# EAGLE schematic kartSPKR_rev_0 (EAGLE 9.4.2)
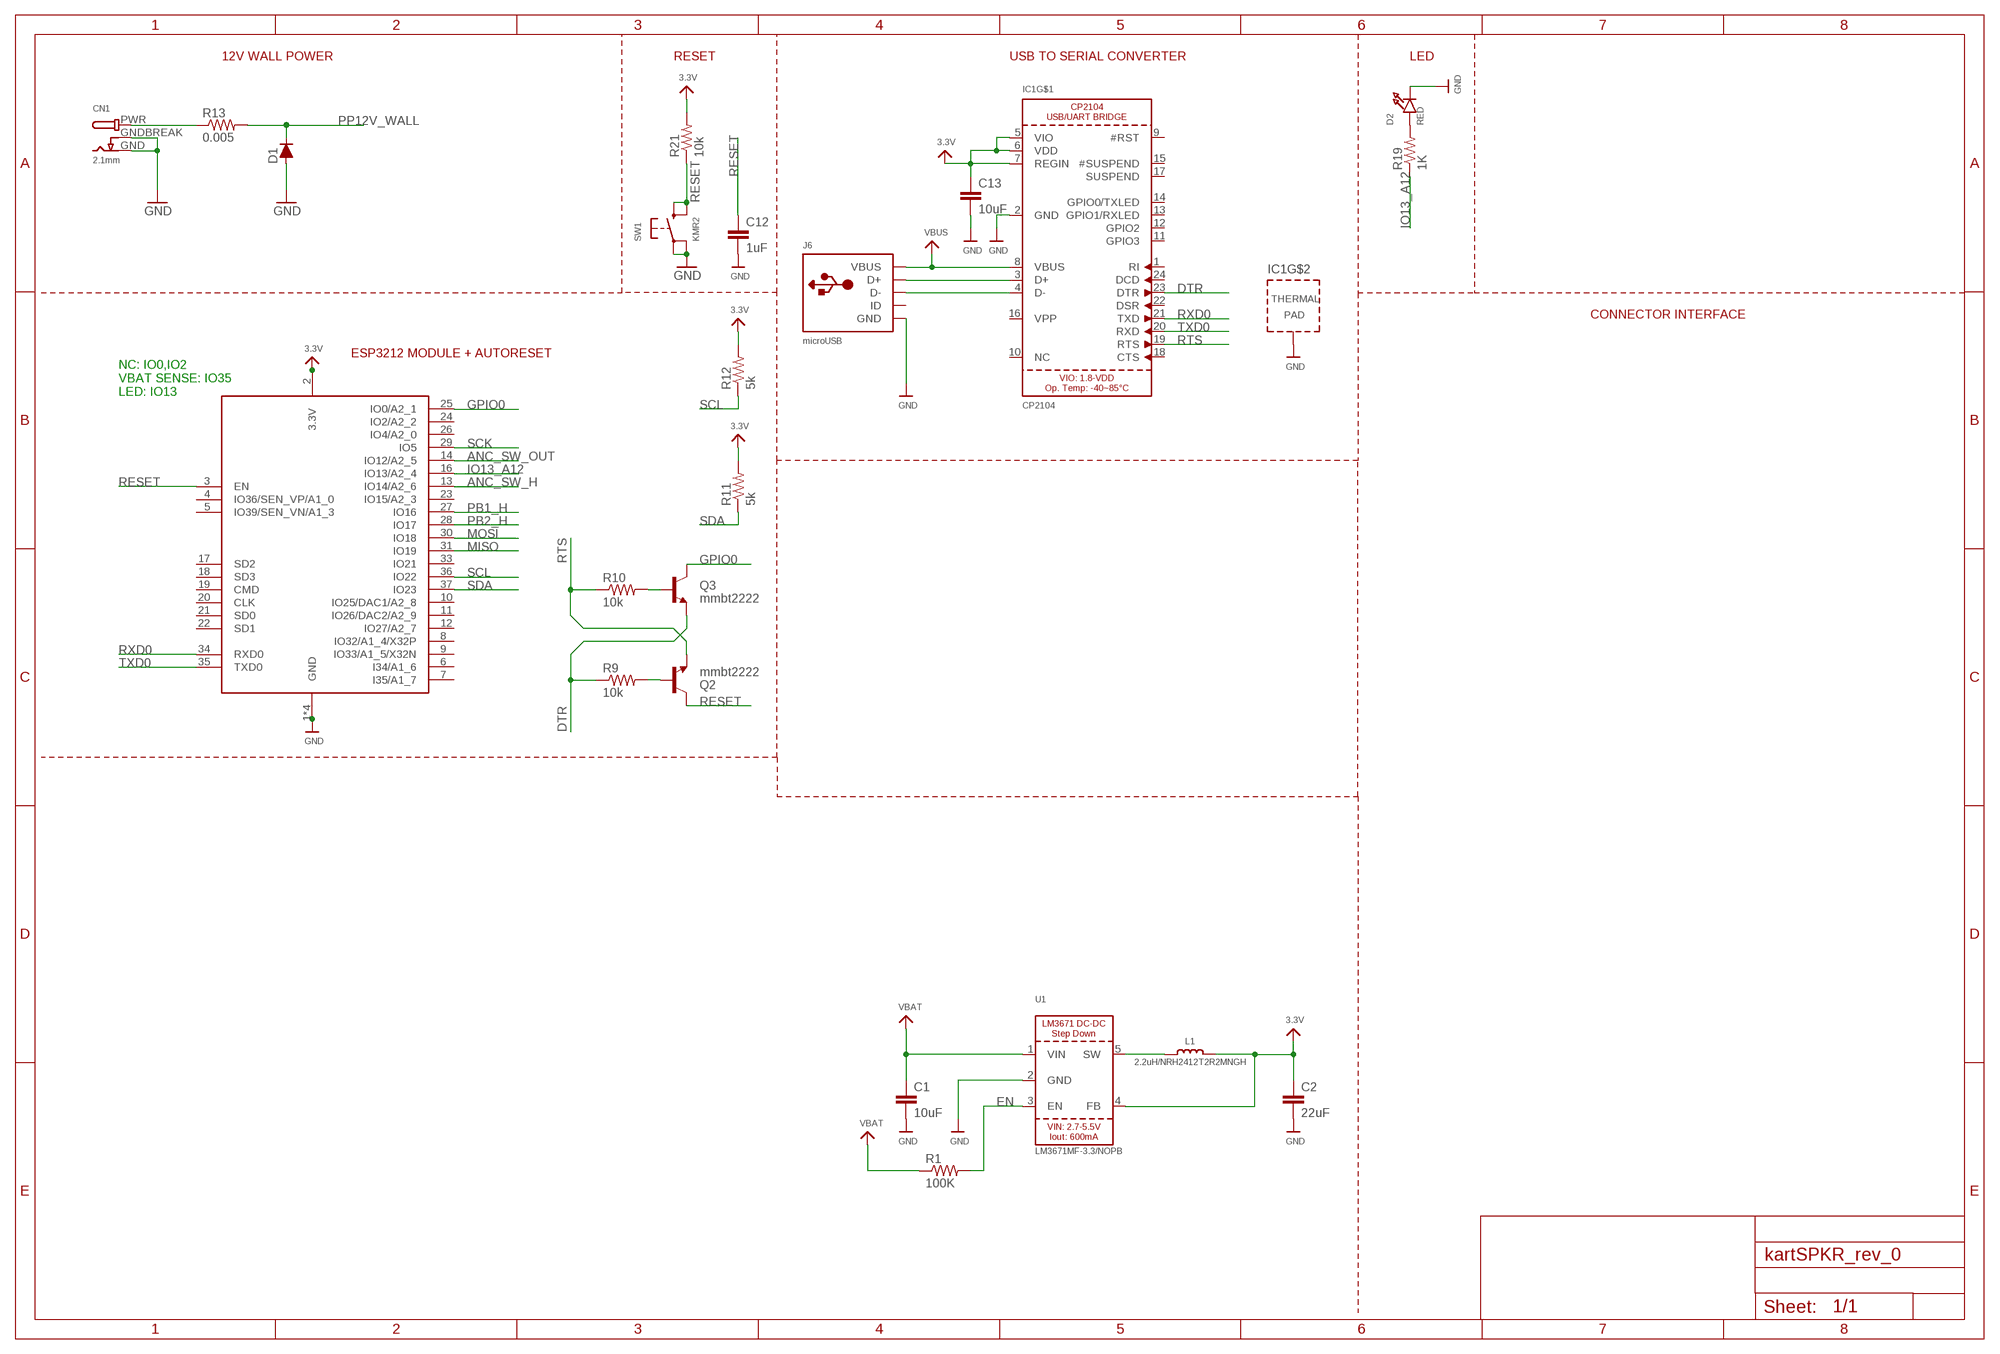
[diagram p0: schematic, sheet 1]

## Parts
C1  10uF  C-EUC0603  [C0603]
C2  22uF  C-EUC0603  [C0603]
C12  1uF  C-EUC0603  [C0603]
C13  10uF  C-EUC0603  [C0603]
CN1  2.1mm  DCBARRELSMT_CORRECT  [DCJACK_2MM_SMT]
D1  D-FILL-SMB  [SMB]
D2  RED  LED0805_NOOUTLINE  [CHIPLED_0805_NOOUTLINE]
IC1  CP2104  [QFN24_4MM_SMSC]
J6  microUSB  USBMICRO_20329  [4UCONN_20329]
L1  2.2uH/NRH2412T2R2MNGH  INDUCTORNRH2412T  [INDUCTOR_TAIYOYUDEN_NRH2412T]
Q2  mmbt2222  TRANSISTOR_NPNSOT23-3  [SOT23-3]
Q3  mmbt2222  TRANSISTOR_NPNSOT23-3  [SOT23-3]
R1  100K  R-US_R0603  [R0603]
R9  10k  R-US_R0603  [R0603]
R10  10k  R-US_R0603  [R0603]
R11  5k  R-US_R0603  [R0603]
R12  5k  R-US_R0603  [R0603]
R13  0.005  R-US_R1206  [R1206]
R19  1K  R-US_R0603  [R0603]
R21  10k  R-US_R0603  [R0603]
SW1  KMR2  SWITCH_TACT_SMT4.6X2.8  [BTN_KMR2_4.6X2.8]
U1  LM3671MF-3.3/NOPB  VREG_LM3671  [SOT23-5]
X1  ESP32_WROOM32_SKINNY  [WROOM32_SKINNY]

## Nets
3.3V: C2.1 C13.1 IC1.5(VIO) IC1.6(VDD) IC1.7(REGIN) L1.2 R11.2 R12.2 R21.2 U1.4(FB) X1.2(3.3V)
ANC_SW_H: X1.13(IO14/A2_6)
ANC_SW_OUT: X1.14(IO12/A2_5)
DTR: IC1.23(DTR) Q3.2(E) R9.1
EN: R1.2 U1.3(EN)
GND: C1.2 C2.2 C12.2 C13.2 CN1.GND CN1.GNDBREAK D1.2(A) D2.C IC1.2(GND) IC1.THERM(TP) J6.BASE@1(GND) J6.BASE@2(GND) J6.GND J6.SPRT@1(GND) J6.SPRT@2(GND) J6.SPRT@3(GND) J6.SPRT@4(GND) SW1.A'(P1) SW1.A(P) U1.2(GND) X1.1(GND) X1.15(GND) X1.38(GND) X1.P$1(GND)
GPIO0: Q3.3(C) X1.25(IO0/A2_1)
IO13_A12: R19.1 X1.16(IO13/A2_4)
MISO: X1.31(IO19)
MOSI: X1.30(IO18)
N$1: CN1.PWR R13.1
N$2: IC1.3(D+) J6.D+
N$5: D2.A R19.2
N$6: IC1.4(D-) J6.D-
N$12: Q2.1(B) R9.2
N$13: Q3.1(B) R10.2
N$17: L1.1 U1.5(SW)
PB1_H: X1.27(IO16)
PB2_H: X1.28(IO17)
PP12V_WALL: D1.1(C) R13.2
RESET: C12.1 Q2.3(C) R21.1 SW1.B'(S1) SW1.B(S) X1.3(EN)
RTS: IC1.19(RTS) Q2.2(E) R10.1
RXD0: IC1.21(TXD) X1.34(RXD0)
SCK: X1.29(IO5)
SCL: R12.1 X1.36(IO22)
SDA: R11.1 X1.37(IO23)
TXD0: IC1.20(RXD) X1.35(TXD0)
VBAT: C1.1 R1.1 U1.1(VIN)
VBUS: IC1.8(VBUS) J6.VBUS
Unconnected: IC1.1(RI) IC1.9(#RST) IC1.10(NC) IC1.11(GPIO3) IC1.12(GPIO2) IC1.13(GPIO1/RXLED) IC1.14(GPIO0/TXLED) IC1.15(#SUSPEND) IC1.16(VPP) IC1.17(SUSPEND) IC1.18(CTS) IC1.22(DSR) IC1.24(DCD) J6.ID X1.4(IO36/SEN_VP/A1_0) X1.5(IO39/SEN_VN/A1_3) X1.6(I34/A1_6) X1.7(I35/A1_7) X1.8(IO32/A1_4/X32P) X1.9(IO33/A1_5/X32N) X1.10(IO25/DAC1/A2_8) X1.11(IO26/DAC2/A2_9) X1.12(IO27/A2_7) X1.17(SD2) X1.18(SD3) X1.19(CMD) X1.20(CLK) X1.21(SD0) X1.22(SD1) X1.23(IO15/A2_3) X1.24(IO2/A2_2) X1.26(IO4/A2_0) X1.33(IO21)

## Notes on the sheet
- 12V WALL POWER | RESET | USB TO SERIAL CONVERTER | LED
- CONNECTOR INTERFACE
- ESP3212 MODULE + AUTORESET
- NC: IO0,IO2
  VBAT SENSE: IO35
  LED: IO13

## Library data of the parts
C1 C2 C12 C13 = rcl:C-EU: CAPACITOR, European symbol
CN1 = microbuilder:DCBARREL: DC Barrel Jack DCJACK_1.3MM_PTH - Through Hole 1.3mm Jack (4UConnector: 05536) DCJACK_2MM_PTH - Through Hole 2.0/2.1 Jack (4UConnector: 05537) DCJACK_2MM_SMT - SMT 2.0/2.1mm Jack(4UConnector: 03267)
D1 = semicon-smd-ipc:D-FILL-: DIODE filled
D2 = microbuilder:LED: LED 0603 - 0603 Surface Mount Package 2mA: Green LED - Low Power (3.9mcd, 2ma, 1.7Vf) - Digikey: 475-2709-2-ND Orange LED - Low Power (9.8mcd, 2ma, 1.8Vf) - Digikey: 475-1194-2-ND Red LED - Low Power (5mcd, 2ma, 1.8Vf) - Digikey: 475-1195-2-ND Yellow LED - Low Power (7mcd, 2ma, 1.8Vf) - Digikey: 475-1196-2-ND 5mA: Blue LED - Low Power (17mcd, 5ma, 2.9Vf) - Digikey: LNJ937W8CRACT-ND 0805 - 0805 Surface Mount Package 2mA: Red LED (8.8mcd, 2mA, 1.8Vf, Clear) - Low Power [Digikey: 475-2510-1-ND] Green LED (5mcd, 2mA, 1.8Vf, Clear) - Low Power [Digikey: 475-2730-1-ND] Yellow LED (11.3mcd, 2mA, 1.8Vf, Clear) - Low Power [Digikey: 475-2555-1-ND] 20mA: Red LED (104mcd, 20mA, Diffused) - LS R976 [Digikey: 475-1278-6-ND] Red LED (12mcd, 20mA, 2.0Vf, Clear) - APT2012EC [Digikey: 754-1128-1-ND] Green LED (15mcd, 20mA, 2.2Vf, Clear) - APT2012GC [Digikey: 754-1131-1-ND] Orange LED (160mcd, 20mA, 2.1Vf, Clear) - APT2012SECK [Digikey: 754-1130-1-ND] 1206 - 1206 Surface Mount Package Green LED (26mcd, 20mA, Diffused) - LG N971 [Digikey: 475-1407-6-ND] Red LED (15mcd, 20mA, Diffused) - LH N974 [Digikey: 475-1416-6-ND] Cree - Cree High-Power Surface Mount LEDs XPEBWT-L1-0000-00D50 - White 111lm 350mA 2.9Vf 6200K 110° XTEAWT-00-0000-00000LEE3 - White 114lm 350mA 2.85Vf 5000K 115° Everlight - Everlight 45-21 Series Surface Mount LEDs 45-21/QK2C-B2832AC2CB2/2T - Warm White 2000mcd 20mA 3.25Vf 3050K 120° 45-21/LK2C-B38452C4CB2/2T - Nuetral White 2000mcd 20mA 3.25Vf 4150K 120° 45-21/LK2C-B50634C6CB2/2T - Cold White 2200mcd 20mA 3.25Vf 5650K 120° PLCC2 Reverse Mount LS T77K-J1L2-1-0-2-R18-Z - Red 11.25mcd 2mA 1.8Vf 630nm 120° LO T77K-L1M2-24-Z - Orange 19.6mcd 2mA 1.8Vf 606nm 120° LY T77K-K2M1-26-Z - Yellow 15.7mcd 2mA 1.8Vf 587nm 120°
IC1 = microbuilder:CP2104: CP2104 - USB to UART Bridge VDD Output: 3.45V
J6 = microbuilder:USB: USB Connectors USBMINIB - Surface Mount Female Mini-B USB Connector 4UConnector: 06564
L1 = microbuilder:INDUCTOR: Inductors 0603: 10nH Ceramic Inductor - microwire antenna/RF (Digikey: 712-1434-2-ND) 0805: 560nH Ceramic Inductor - RF (Digikey: 553-1047-1-ND) 270nH Ceramic Inductor - Q = 40@250MHz, +-5%, 1 Ohm DC Resistance (Digikey: 535-10506-2-ND) 1007 (2518 Metric) SMT: 10µH 10% 250mOhm 820mA 1007 Inductor (Digikey: 587-2189-1-ND) 22µH 10% 500mOhm 580mA 1007 Inductor (Digikey: 587-2190-1-ND) 47µH 10% 950mOhm 420mA 1007 Inductor (Digikey: 587-2191-1-ND) 47µH 5% 100mOhm 1A 1008 Inductor (Digikey: 732-1816-1-ND) 5.0x5.0mm (Taiyo Yuden NR5040 Series) 6.8µH 20% 2.3A 64mOhm Inductor (Digikey: 587-2374-2-ND) 5.0x5.0mm (TDK VLC5045 Series) 4.7µH 20% 3.3A 34mOhm Inductor (Digikey: 445-6526-1-ND) 6.8µH 20% 2.7A 46mOhm Inductor (Digikey: 445-6527-1-ND) 6.0x6.0mm (TDK VLC6045 Series) 4.7µH 20% 3.8A 27mOhm Inductor (Digikey: 445-6538-2-ND) 6.8µH 20% 3A 41mOhm Inductor (Digikey: 445-6540-1-ND) 6.2µH 30% 2.2A 45mOhm Inductor (Digikey: SRR5028-6R2YCT-ND) - Not TDK VLC6045 but footprint should match 6.0x6.0mm (TDK SLF6045 Series) 6.8uH 30% 2A 33mOhm Inductor (Digikey: 445-4572-1-ND, Mouser: 810-SLF645T6R8N2R0PF) 6.0x6.0mm (Sumida CDRH5D28 Series) 6.2uH 30% 1.8A 45mOhm Inductor (Digikey: 308-1542-1-ND) Taiyo Yuden NR3015T2R2M - 2.2uH 20% 1.5A (Digikey: 587-1648-2-ND, Mouser: 963-NR3015T2R2M) - Used with TI TPS62172 CoilCraft RFID Transponder Coil - MA5532-AE (For use with AS3935 Lightning Sensor) Taiyo Yuden NRH2412T2R2MNGH - 2.2uH 20% 1AA (Digikey: 587-3443-1-ND) - Used with TI LM3671 Vishay IHLP 1.0uH Molded Inductor - 24mOhm DCR, 5A, +/-20%, -55°C-125°C (Digikey: 541-1319-1-ND)
Q2 Q3 = SparkFun:TRANSISTOR_NPN: Transistor NPN BJT configuration in SOT23 package. MMBT2222 is the common NPN we use. Double check BCE configuration again layout.
R1 R9-R13 R19 R21 = rcl:R-US_: RESISTOR, American symbol; SPICEPREFIX: R
SW1 = microbuilder:SWITCH_TACT_SMT: SMT Tact Switches 6x6mm - Digikey: P12940SCT-ND KMR2 (4.6x2.8mm) - Digikey: 401-1426-1-ND EVQ-PQHB55 - Light Touch, 160GF (4.5x4.5mm) - Digikey: P8090SCT-ND KMT0 - KMT021 NGJ LHS (etc.) IP68/Waterproof - Digikey: CKN10289CT-ND
U1 = microbuilder:VREG_LM3671: LM3671 - 600mA DC-DC Step-Down Converter VIN: 2.7-5.5V Load Current: 600mA Switching Frequency: 2MHz Iq: 16uA
X1 = microbuilder:ESP32_WROOM32

## Net classes
0 default: clearance 0.254 mm
1 power: width 0.178 mm, clearance 0.381 mm